# EAGLE design charger_1.2 (EAGLE 7.4.0)
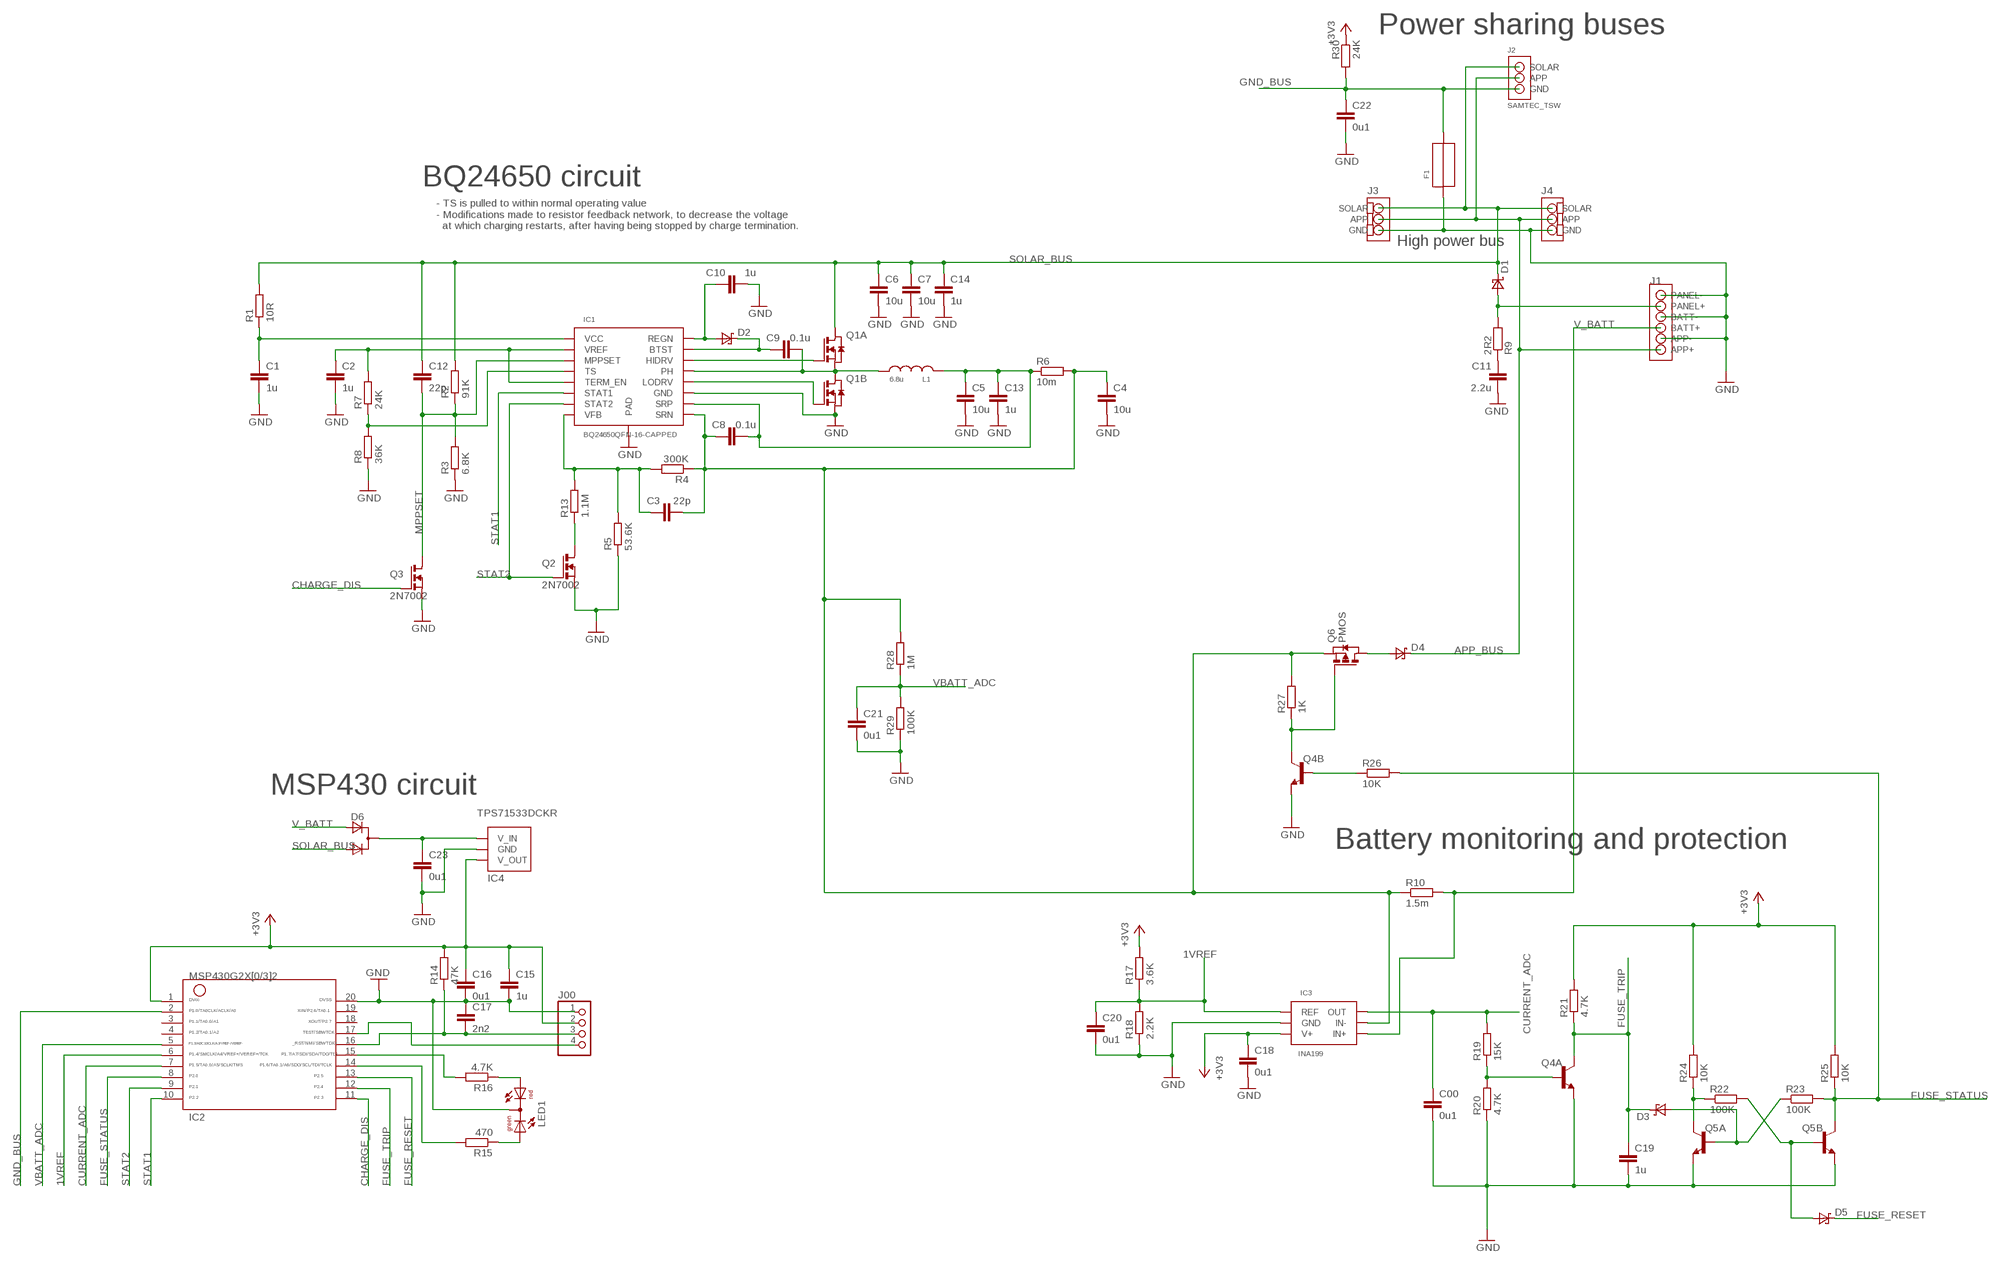
[diagram p0: schematic, sheet 1]

## Parts
C00  0u1  C-EUC0603K  [C0603K]
C1  1u  C-EUC0603  [C0603]
C2  1u  C-EUC0603  [C0603]
C3  22p  C-EUC0603  [C0603]
C4  10u  C-EUC1206  [C1206]
C5  10u  C-EUC1206  [C1206]
C6  10u  C-EUC1206  [C1206]
C7  10u  C-EUC1206  [C1206]
C8  0.1u  C-EUC0603  [C0603]
C9  0.1u  C-EUC0603  [C0603]
C10  1u  C-EUC0603  [C0603]
C11  2.2u  C-EUC0603  [C0603]
C12  22p  C-EUC0603  [C0603]
C13  1u  C-EUC0603  [C0603]
C14  1u  C-EUC0603  [C0603]
C15  1u  C-EUC0603K  [C0603K]
C16  0u1  C-EUC0603K  [C0603K]
C17  2n2  C-EUC0603K  [C0603K]
C18  0u1  C-EUC0603K  [C0603K]
C19  1u  C-EUC0603  [C0603]
C20  0u1  C-EUC0603K  [C0603K]
C21  0u1  C-EUC0603K  [C0603K]
C22  0u1  C-EUC0603K  [C0603K]
C23  0u1  C-EUC0603K  [C0603K]
D1  SCHOTTKYDPAK  [DPAK]
D2  SCHOTTKYSOT23  [SOT23]
D3  SCHOTTKYSOD-523F  [SOD-523F]
D4  SCHOTTKYSO8-FLAT  [SO8-FLAT]
D5  SCHOTTKYSOD-523F  [SOD-523F]
D6  D_2ASOT23  [SOT-23]
F1  FUSE2920  [2920]
IC1  BQ24650QFN-16-CAPPED  [QFN-16-CAPPED]
IC2  G2X[0/3]2---PW20  [PW20]
IC3  INA199  [SC70-6]
IC4  TPS71533DCKR  [SC70-5]
J00  PINHD-1X4  [1X04]
J1  TERMINALBLOCK  [TERMINALBLOCK]
J2  SAMTEC_TSW  [SAMTEC_TSW]
J3  TERMINALBLOCK_3_REV  [TERMINALBLOCK_3_REV]
J4  TERMINALBLOCK_3  [TERMINALBLOCK_3]
L1  6.8u  MULTICOMPINDUCTOR  [INDUCTOR]
LED1  DUOLED5MM  [DUOLED5MM]
Q1  SI7288DP  [POWERPAK-SO8-DUAL]
Q2  2N7002  [SOT23]
Q3  2N7002  [SOT23]
Q4  DUALNPN  [SC70-6]
Q5  DUALNPN  [SC70-6]
Q6  PMOS  [POWERPAK-SO8]
R1  10R  R-EU_R0603  [R0603]
R2  91K  R-EU_R0603  [R0603]
R3  6.8K  R-EU_R0603  [R0603]
R4  300K  R-EU_R0603  [R0603]
R5  53.6K  R-EU_R0805  [R0805]
R6  10m  R-EU_R1206  [R1206]
R7  24K  R-EU_R0603  [R0603]
R8  36K  R-EU_R0603  [R0603]
R9  2R2  R-EU_R0603  [R0603]
R10  1.5m  R-EU_R2010  [R2010]
R13  1.1M  R-EU_R0603  [R0603]
R14  47K  R-EU_R0603  [R0603]
R15  470  R-EU_R0603  [R0603]
R16  4.7K  R-EU_R0603  [R0603]
R17  3.6K  R-EU_R0603  [R0603]
R18  2.2K  R-EU_R0603  [R0603]
R19  15K  R-EU_R0603  [R0603]
R20  4.7K  R-EU_R0603  [R0603]
R21  4.7K  R-EU_R0603  [R0603]
R22  100K  R-EU_R0603  [R0603]
R23  100K  R-EU_R0603  [R0603]
R24  10K  R-EU_R0603  [R0603]
R25  10K  R-EU_R0603  [R0603]
R26  10K  R-EU_R0603  [R0603]
R27  1K  R-EU_R0603  [R0603]
R28  1M  R-EU_R0805  [R0805]
R29  100K  R-EU_R0603  [R0603]
R30  24K  R-EU_R0603  [R0603]

## Nets
1VREF: C20.1 IC2.6 IC3.EMITTER-B-1(REF) R17.1 R18.2
+3V3: C15.1 C16.1 C18.1 IC2.1 IC3.COLLECTOR-A-3(V+) IC4.OUT(V_OUT) J00.2 R14.2 R17.2 R21.2 R24.2 R25.2 R30.1
APP_BUS: D4.CATHODE J1.APP+ J2.APP J3.APP J4.APP
CHARGE_DIS: IC2.11 Q3.ANODE(G)
CURRENT_ADC: C00.1 IC2.7 IC3.COLLECTOR-B-6(OUT) R19.2
FUSE_RESET: D5.CATHODE IC2.13
FUSE_STATUS: IC2.8 Q5.COLLECTOR-B-6(B:COLLECTOR) R23.2 R25.1 R26.2
FUSE_TRIP: C19.1 D3.CATHODE IC2.12 Q4.COLLECTOR-A-3(A:COLLECTOR) R21.1
GND: C00.2 C1.2 C2.2 C4.2 C5.2 C6.2 C7.2 C10.2 C11.2 C13.2 C14.2 C15.2 C16.2 C17.1 C18.2 C19.2 C20.2 C21.2 C22.2 C23.2 F1.P$1 IC1.GND-P11(GND) IC1.P$17(PAD) IC1.P$18(PAD) IC1.P$19(PAD) IC1.P$20(PAD) IC2.20 IC3.BASE-B-2(GND) IC4.GND J00.1 J1.APP- J1.BATT- J1.PANEL- J3.GND J4.GND LED1.K(C) Q1.S2(B:S) Q2.NC(S) Q3.NC(S) Q4.EMITTER-B-1(B:EMMITER) Q4.EMMITER-A-4(A:EMMITER) Q5.EMITTER-B-1(B:EMMITER) Q5.EMMITER-A-4(A:EMMITER) R3.1 R5.1 R8.1 R18.1 R20.1 R29.1
GND_BUS: C22.1 F1.P$2 IC2.2 J2.GND R30.2
MPPSET: C12.2 IC1.MPPSET-P2(MPPSET) Q3.CATHODE(D) R2.1 R3.2
N$1: IC2.15 R16.2
N$2: IC1.HIDRV-P15(HIDRV) Q1.G1(A:G)
N$3: Q2.CATHODE(D) R13.1
N$4: LED1.AR R16.1
N$5: C9.2 IC1.PH-P14(PH) L1.P$2 Q1.D2A(B:D) Q1.D2B(B:D) Q1.D2C(B:D) Q1.S1(A:S)
N$6: IC1.TS-P4(TS) R7.1 R8.2
N$7: C9.1 D2.CATHODE IC1.BTST-P16(BTST)
N$8: IC1.LODRV-P13(LODRV) Q1.G2(B:G)
N$9: C3.1 IC1.VFB-P8(VFB) R4.2 R5.2 R13.2
N$10: C10.1 D2.ANODE IC1.REGN-P12(REGN)
N$11: IC2.17 J00.4
N$12: Q4.BASE-A-5(A:BASE) R19.1 R20.2
N$13: LED1.AG R15.1
N$15: D5.ANODE Q5.BASE-B-2(B:BASE) R22.2
N$16: Q5.COLLECTOR-A-3(A:COLLECTOR) R22.1 R24.1
N$17: C2.1 IC1.TERM_EN-P7(TERM_EN) IC1.VREF-P6(VREF) R7.2
N$18: D3.ANODE Q5.BASE-A-5(A:BASE) R23.1
N$19: Q4.COLLECTOR-B-6(B:COLLECTOR) Q6.G R27.1
N$20: D4.ANODE1(ANODE) D4.ANODE2(ANODE) D4.ANODE3(ANODE) Q6.D1(D) Q6.D2(D) Q6.D3(D) Q6.D4(D)
N$21: IC2.14 R15.2
N$22: Q4.BASE-B-2(B:BASE) R26.1
N$25: C23.1 D6.1(C) IC4.IN(V_IN)
N$40: C17.2 IC2.16 J00.3 R14.1
SOLAR_BUS: C6.1 C7.1 C12.1 C14.1 D1.CATHODE D6.3(A2) J2.SOLAR J3.SOLAR J4.SOLAR Q1.D1A(A:D) Q1.D1B(A:D) Q1.D1C(A:D) R1.2 R2.2
SOLAR_IN: D1.ANODE1(ANODE) D1.ANODE2(ANODE) J1.PANEL+ R9.2
SRP: C5.1 C8.2 C13.1 IC1.SRP-P10(SRP) L1.P$1 R6.1
STAT1: IC1.STAT1-P3(STAT1) IC2.10
STAT2: IC1.STAT2-P5(STAT2) IC2.9 Q2.ANODE(G)
V_BATT: D6.2(A1) IC3.EMMITER-A-4(IN+) J1.BATT+ R10.2
V_CHARGE: C3.2 C4.1 C8.1 IC1.SRN-P9(SRN) IC3.BASE-A-5(IN-) Q6.S1(S) Q6.S2(S) Q6.S3(S) R4.1 R6.2 R10.1 R27.2 R28.2
VBATT_ADC: C21.1 IC2.5 R28.1 R29.2
VCC: C1.1 IC1.VCC-P1(VCC) R1.1
VCC1: C11.1 R9.1
Unconnected: IC2.3 IC2.4 IC2.18 IC2.19

## Notes on the sheet
- Power sharing buses
- BQ24650 circuit
- - TS is pulled to within normal operating value
   - Modifications made to resistor feedback network, to decrease the voltage
     at which charging restarts, after having being stopped by charge termination.
- High power bus
- MSP430 circuit
- Battery monitoring and protection

## Library data of the parts
C00 C1-C23 = rcl:C-EU: CAPACITOR, European symbol
D1-D5 = myChargerLib:SCHOTTKY: DIODE
D6 = zetex:D_2A: Dual DIODE; OC_FARNELL: unknown; OC_NEWARK: unknown
F1 = mylib:FUSE
IC1 = myChargerLib:BQ24650
IC2 = TI_MSP430_v16:G2X[0/3]2---PW20: MSP430G2X[0/3]2 MSP430G2x32, MSP430G2x02 TSSOP (PW) 20 Pin Package http://focus.ti.com/docs/prod/folders/print/msp430g2432.html
IC3 = myChargerLib:INA199
IC4 = mylib:TPS71533DCKR
J00 = pinhead:PINHD-1X4: PIN HEADER
J1 = myChargerLib:TERMINALBLOCK
J2 = myChargerLib:SAMTEC_TSW
J3 = myChargerLib:TERMINALBLOCK_3_REV
J4 = myChargerLib:TERMINALBLOCK_3
L1 = myChargerLib:MULTICOMPINDUCTOR
LED1 = mylib:DUOLED5MM: DUO LED 2 colors, 5 mm, round
Q1 = myChargerLib:SI7288DP
Q2 Q3 = myChargerLib:2N7002
Q4 Q5 = myChargerLib:DUALNPN
Q6 = myChargerLib:PMOS
R1-R10 R13 R14 R17-R30 = rcl:R-EU_: RESISTOR, European symbol
R15 R16 = resistor:R-EU_: RESISTOR, European symbol

## Board
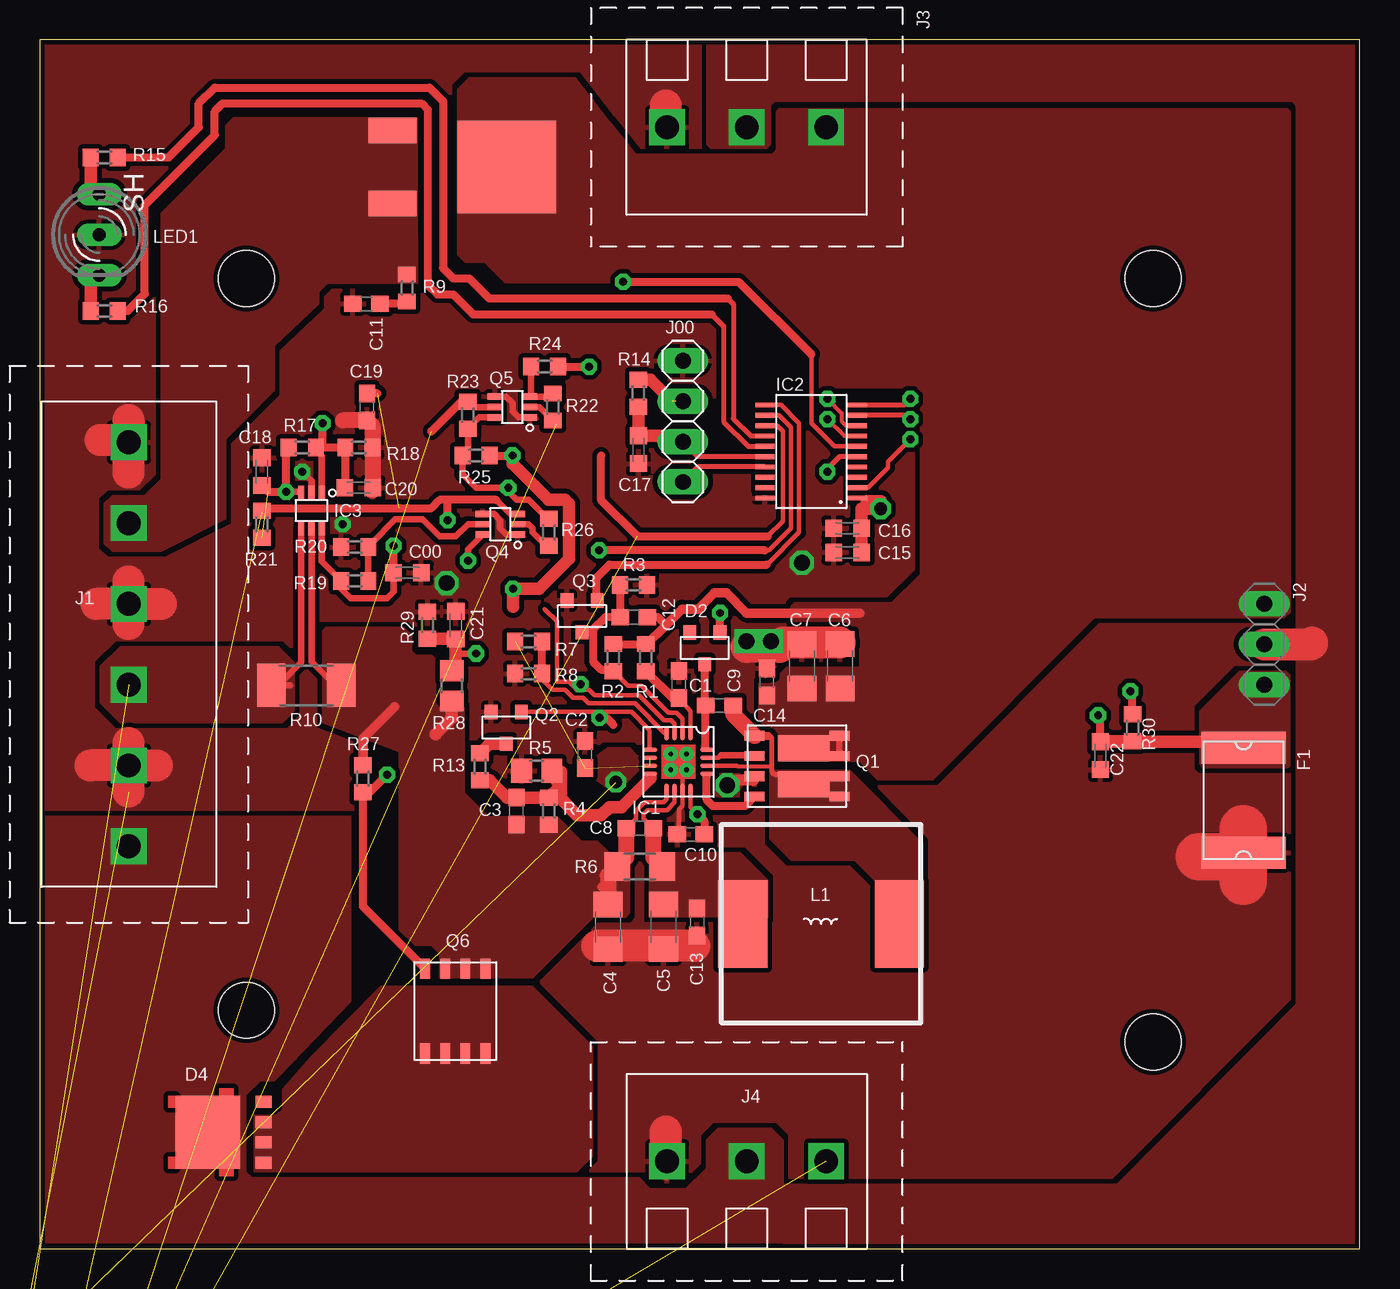
[diagram p1: board, top side]
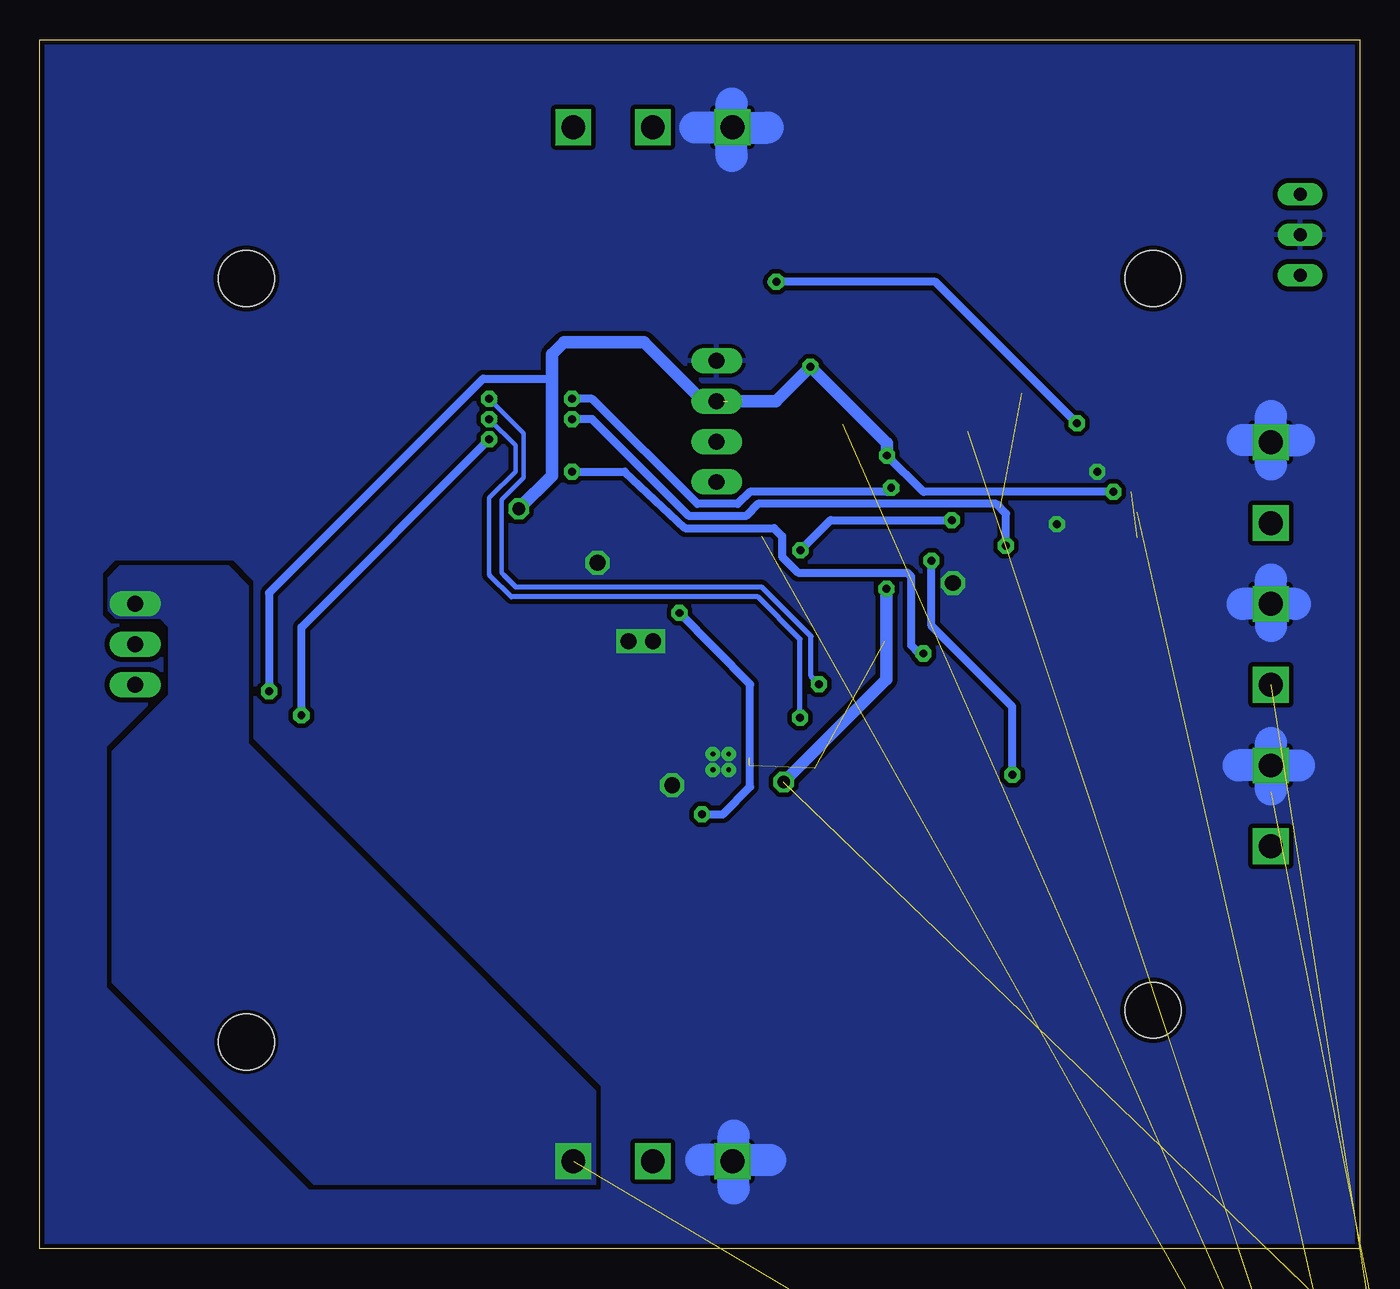
[diagram p2: board, bottom side, seen from below]

Size 83 x 76 mm. Coordinates in mm from the lower left corner, seen from the top.
Outline: 0,76 0,0 83,0 83,76 0,76
Copper layers (1*16): Top 0.035mm / dielectric 1.5mm / Bottom 0.035mm
Design rules "SparkFun *": minimum track width 8mil, minimum drill 10mil, track to track 8mil, track to pad 8mil, pad to pad 8mil, via to via 8mil, smd to smd 8mil, copper to edge 10mil, drill to drill 8mil, minimum pad ring 12mil, minimum via ring 10mil, stop-mask expansion 4mil, vias tented up to drill 25mil, thermal gap 10mil
Holes 3.5 mm at 13,61 13,15 70,13 70,61
tKeepout: area 9.5,57.5 to 16.5,64.5; area 9.5,11.5 to 16.5,18.5; area 66.5,57.5 to 73.5,64.5; area 66.5,9.5 to 73.5,16.5

### Footprints (pad centres in the part's own frame; a part is rotated, then mirrored left to right if it is on the bottom)
C0603K = smd 1.05 x 1.08: 1 -0.875,0; 2 0.875,0
C0603 = smd 1.1 x 1: 1 -0.85,0; 2 0.85,0
C1206 = smd 1.6 x 1.8: 1 -1.4,0; 2 1.4,0
DPAK = smd 3 x 1.6: ANODE1 4.08,5.185; ANODE2 4.08,0.615 | smd 6.2 x 5.8: CATHODE -3.1,2.9
SOT23 = smd 0.8 x 0.9: ANODE 0.95,0.975; CATHODE 0,-1.025; NC -0.95,0.975
SOD-523F = smd 0.5 x 0.8: ANODE 0,-1; CATHODE 0,1
SO8-FLAT = smd 0.75 x 1: ANODE1 4.185,5.52; ANODE2 2.915,5.52; ANODE3 1.645,5.52; NC-4 0.375,5.52 | smd 4.56 x 4.055: CATHODE 2.28,2.027
SOT-23 = smd 0.787 x 0.889: 1 0.025,-1.016; 2 -0.94,1.016; 3 0.991,1.016
2920 = smd 2 x 5.3: P$1 3.3,0; P$2 -3.3,0
QFN-16-CAPPED = smd 0.9 x 0.28: BTST-P16 1.8,0.75; HIDRV-P15 1.8,0.25; LODRV-P13 1.8,-0.75; PH-P14 1.8,-0.25; STAT2-P5 -1.8,0.75; TERM_EN-P7 -1.8,-0.25; VFB-P8 -1.8,-0.75; VREF-P6 -1.8,0.25 | smd 0.28 x 0.9: GND-P11 0.25,-1.8; MPPSET-P2 0.25,1.8; REGN-P12 0.75,-1.8; SRN-P9 -0.75,-1.8; SRP-P10 -0.25,-1.8; STAT1-P3 -0.25,1.8; TS-P4 -0.75,1.8; VCC-P1 0.75,1.8 | drill 0.3 pad 0.4: P$17 -0.5,0.5; P$18 0.5,0.5; P$19 0.5,-0.5; P$20 -0.5,-0.5
PW20 = smd 0.3 x 1.2: 1 -2.925,-2.9; 2 -2.275,-2.9; 3 -1.625,-2.9; 4 -0.975,-2.9; 5 -0.325,-2.9; 6 0.325,-2.9; 7 0.975,-2.9; 8 1.625,-2.9; 9 2.275,-2.9; 10 2.925,-2.9; 11 2.925,2.9; 12 2.275,2.9; 13 1.625,2.9; 14 0.975,2.9; 15 0.325,2.9; 16 -0.325,2.9; 17 -0.975,2.9; 18 -1.625,2.9; 19 -2.275,2.9; 20 -2.925,2.9
SC70-6 = smd 0.4 x 0.9: BASE-A-5 0,1.1; BASE-B-2 0,-1.1; COLLECTOR-A-3 0.65,-1.1; COLLECTOR-B-6 -0.65,1.1; EMITTER-B-1 -0.65,-1.1; EMMITER-A-4 0.65,1.1
SC70-5 = smd 0.4 x 0.7: FB/NC -0.65,-0.85; GND 0,-0.85; IN 0.65,0.85; NC 0.65,-0.85; OUT -0.65,0.85
1X04 = drill 1 long: 1 -3.81,0; 2 -1.27,0; 3 1.27,0; 4 3.81,0
TERMINALBLOCK = drill 1.5 square: APP+ 12.7,0; APP- 7.62,0; BATT+ 2.54,0; BATT- -2.54,0; PANEL+ -7.62,0; PANEL- -12.7,0
SAMTEC_TSW = drill 1 long: APP 0,0; GND 2.54,0; SOLAR -2.54,0
TERMINALBLOCK_3_REV = drill 1.5 square: APP 0,-5; GND 0,-10; SOLAR 0,0
TERMINALBLOCK_3 = drill 1.5 square: APP 0,-5; GND 0,-10; SOLAR 0,0
INDUCTOR = smd 3.1 x 5.5: P$1 -4.925,0; P$2 4.925,0
DUOLED5MM = drill 0.813 long: AG -2.54,0; AR 2.54,0; K 0,0
POWERPAK-SO8-DUAL = smd 1.27 x 0.61: D1A 2.67,1.905; D1B 2.67,0.635; D2A 2.67,-0.635; D2B 2.67,-1.905; G1 -2.67,0.635; G2 -2.67,-1.905; S1 -2.67,1.905; S2 -2.67,-0.635 | smd 3.25 x 1.65: D1C 0.41,1.13; D2C 0.41,-1.13
POWERPAK-SO8 = smd 1.27 x 0.61: D1 2.67,1.905; D2 2.67,0.635; D3 2.67,-0.635; D4 2.67,-1.905; G -2.67,-1.905; S1 -2.67,1.905; S2 -2.67,0.635; S3 -2.67,-0.635
R0603 = smd 1 x 1.1: 1 -0.85,0; 2 0.85,0
R0805 = smd 1.3 x 1.5: 1 -0.95,0; 2 0.95,0
R1206 = smd 1.6 x 1.803: 1 -1.422,0; 2 1.422,0
R2010 = smd 1.8 x 2.7: 1 -2.2,0; 2 2.2,0

### Placement (x,y rotation side)
C00  23.11,42.5 0 top
C1  40.19,35.48 90 top
C2  34.29,31.07 90 top
C3  29.97,27.52 270 top
C4  35.73,20.23 270 top
C5  39.22,20.25 270 top
C6  50.33,36.63 90 top
C7  47.93,36.63 90 top
C8  37.73,26.43 0 top
C9  42.74,34.15 0 top
C10  40.94,26.06 180 top
C11  20.53,59.41 180 top
C12  37.34,39.71 180 top
C13  41.33,20.53 270 top
C14  45.73,35.63 90 top
C15  50.8,43.77 180 top
C16  50.8,45.3 180 top
C17  37.64,50.24 90 top
C18  13.97,48.85 90 top
C19  20.57,52.92 270 top
C20  20.07,47.84 0 top
C21  26.16,39.2 90 top
C22  66.7,31 270 top
C23  -3,-18 0 top  (outside the outline)
D1  26.27,70.9 180 top
D2  41.82,37.77 0 top
D3  -4,-34 0 top  (outside the outline)
D4  8.56,9.61 270 top
D5  -4,-30 0 top  (outside the outline)
D6  -3,-26 0 top  (outside the outline)
F1  75.69,28.19 270 top
IC1  40.17,30.61 0 top
IC2  48.51,50.12 90 top
IC3  17.09,46.41 180 top
IC4  -2,-9 0 top  (outside the outline)
J00  40.44,52.01 270 top
J1  5.6,38 270 top
J2  77,38 270 top
J3  49.45,70.5 270 top
J4  49.45,5.5 270 top
L1  49.13,20.43 0 top
LED1  3.75,63.75 270 top
Q1  47.62,30.34 0 top
Q2  29.33,32.78 0 top
Q3  34.1,39.78 0 top
Q4  28.96,45.55 90 top
Q5  29.72,52.92 90 top
Q6  26.13,14.94 270 top
R1  38.1,37.17 90 top
R2  36.07,37.17 90 top
R3  37.34,41.74 180 top
R4  32,27.52 90 top
R5  31.24,30.06 0 top
R6  37.73,24.03 180 top
R7  30.73,38.18 180 top
R8  30.73,36.15 0 top
R9  23.1,60.4 90 top
R10  16.76,35.42 180 top
R13  27.69,30.31 270 top
R14  37.64,53.79 90 top
R15  4.06,68.61 0 top
R16  4.06,58.96 0 top
R17  16.51,50.38 180 top
R18  20.07,50.38 180 top
R19  19.81,41.99 180 top
R20  19.81,44.11 0 top
R21  13.97,45.55 270 top
R22  32.26,52.92 270 top
R23  26.92,52.41 270 top
R24  31.75,55.46 0 top
R25  27.43,49.87 0 top
R26  32,45.04 90 top
R27  20.32,29.55 90 top
R28  25.91,35.39 270 top
R29  24.38,39.2 270 top
R30  68.72,32.75 270 top

### Tracks (layer width: path | path; a pad name or v marks a point on that pad's centre or on a via)
1VREF  (via drill 0.5)
  Top 0.28: 48.51,56.22 48.51,51.9 49.97,50.45 IC2.6
  Top 0.4: IC3.EMITTER-B-1 17.74,49.87 R17.1
  Top 0.5: R17.1 17.53,50.38 | 17.53,50.38 R18.2 19.22,47.84 C20.1 | 17.53,50.38 17.78,50.63 v17.78,51.9 | v36.69,60.79 43.94,60.79 48.51,56.22
  Bottom 0.5: v17.78,51.9 26.67,60.79 v36.69,60.79 37,60.79
+3V3  (via drill 0.5, 0.8)  (3 unrouted)
  Top 0.3: 52,47 52,47.2 IC2.1
  Top 0.4: IC3.COLLECTOR-A-3 16.37,47.58 v15.49,47.58
  Top 0.5: R24.2 v34.54,55.46 | R25.2 v29.72,49.87 | C18.1 14.37,47.58 v15.49,47.58 15.49,49.87 R17.2 | R30.1 68.72,34.92 v68.58,35.05
  Top 0.8: R14.2 38.41,54.64 39.76,53.28 J00.2 | C15.1 C16.1 51.67,46.52 v52.88,46.52 52.88,47 52,47 | 29.75,40.35 v29.75,41.48 29.76,41.5 31.4,41.5 33.27,43.37 33.27,46.82 33.02,47.07 32,47.07 29.72,49.36 v29.72,49.87
  Bottom 0.5: v15.49,47.58 27.43,47.58 v29.72,49.87 | 50.8,54.69 55.12,54.69 68.58,41.23 v68.58,35.05
  Bottom 0.8: v29.72,49.87 29.72,50.63 v34.54,55.46 36.72,53.28 40,53.28 | J00.2 41.28,53.28 45,57 50.02,57 50.8,56.22 50.8,54.69 50.8,48.6 v52.88,46.52 | 29.72,41.51 v29.75,41.48 29.75,35.81 v36.22,29.34
  pour Top (isolate 0.305, no thermals): 38.7,31 37.6,31 37.1,31.5 35.7,31.5 34.75,30.8 34.75,29.6 35.56,29.04 36.64,29.04 37.9,30.3 38.6,30.3 38.7,30.4
APP_BUS
  Top 2: J2.APP 79.91,38 arc90 80.01,38.1
  pour Top (isolate 0.305, no thermals): 12.95,9.68 12.95,4.86 13.32,4.49 37.68,4.49 38.35,3.81 40.64,3.81 41.91,5.08 41.91,6.86 42.67,7.62 45.97,7.62 46.74,6.86 46.74,0.35 0.35,0.35 0.35,27.21 19.56,27.21 19.56,15.53 14.99,10.79 14.73,10.54 13.84,10.54 12.99,9.68
  pour Top (isolate 0.305, no thermals): 46.74,0.35 82.7,0.35 82.7,75.69 41.91,75.69 41.91,69.44 42.16,69.19 45.72,69.19 45.97,69.44 45.97,71.88 46.23,72.14 78.74,72.14 78.99,71.88 78.99,15.34 67.72,4.06 46.74,4.06
CHARGE_DIS
  Top 0.28: 45.72,43.01 47.75,45.04 47.75,51.9 46.6,53.05 IC2.11
  Top 0.5: Q3.ANODE 35,40.81 35,42.2 35.81,43.01 45.72,43.01
CURRENT_ADC  (via drill 0.5)
  Top 0.25: v49.53,52.15 50.59,51.1 IC2.7
  Top 0.4: IC3.COLLECTOR-B-6 17.74,43.22 R19.2 18.96,41.49 19.56,40.89 21.84,40.89 22.24,41.29 C00.1
  Top 0.5: C00.1 v22.24,44.19 v22.25,44.2
  Bottom 0.5: v22.25,44.2 22.25,46.21 22.86,46.82 37.85,46.82 38.61,46.06 42.16,46.06 48.26,52.15 v49.53,52.15
FUSE_RESET  (1 unrouted)
  Top 0.28: 45.77,44.79 46.74,45.75 46.74,51.39 46.38,51.75 IC2.13
  Top 0.5: 45.77,44.79 37.58,44.79 35.31,47.06 35.31,49.87
FUSE_STATUS  (via drill 0.5)
  Top 0.25: v49.53,53.42 50.42,52.53 50.42,52.03 50.7,51.75 IC2.8
  Top 0.4: Q5.COLLECTOR-B-6 27.61,52.27 R23.2 26.92,50.21 R25.1 26.58,48.69 27.43,47.84 29.21,47.84 29.97,47.07 30.73,47.07 31.92,45.89 R26.2
  Top 0.5: 29.21,47.84 v29.46,47.84
  Bottom 0.5: v49.53,53.42 48.26,53.42 41.66,46.82 39.12,46.82 38.35,47.58 29.72,47.58 v29.46,47.84
FUSE_TRIP  (via drill 0.5)  (2 unrouted)
  Top 0.28: IC2.12 45.62,52.41 46.48,52.41 47.24,51.65 47.24,45.3 45.85,43.9 45.59,43.9
  Top 0.4: Q4.COLLECTOR-A-3 29.58,46.2 28.7,47.07
  Top 0.5: 28.7,47.07 25.65,47.07 | 25.65,47.07 25.15,47.07 24.64,46.57 23.11,46.57 | 13.97,46.31 R21.1 13.97,46.57 22.61,46.57 | 22.61,46.57 23.11,46.57 | 23.11,46.58 23.11,46.57 | 22.6,46.58 22.61,46.57 | 21.24,53.77 C19.1 | 45.59,43.9 v35.18,43.9 | v25.65,45.8 25.65,47.07
  Bottom 0.5: v35.18,43.9 33.27,45.8 v25.65,45.8
GND  (via drill 0.5, 1)  (2 unrouted)
  Top 0.2: Q1.S2 44.95,29.54 44.86,29.45
  Top 0.28: IC1.P$19 40.42,29.86 IC1.GND-P11 40.42,27.86 40.18,27.62 40.18,25.99
  Top 0.4: Q5.EMITTER-B-1 30.11,52.27 29.72,52.66 29.72,53.17 29.32,53.57 Q5.EMMITER-A-4 | Q4.EMMITER-A-4 28.56,46.2 28.96,45.8 28.96,45.3 29.35,44.9 Q4.EMITTER-B-1 | 17.09,48.26 arc-90 17.09,48.26 | IC3.BASE-B-2 17.09,48.26 | 17.09,48.26 17.09,48.27 v16.51,48.85
  Top 0.5: C13.2 41.15,19.5 41.15,19.05 | 40.18,25.99 40.13,26.04 40.13,26.16 40.09,26.12 C10.2
  Top 0.7: 44.86,29.45 43.64,29.45 43.23,29.04
  Top 1: 19.07,52.08 C19.2 20.92,51.72 20.92,47.68
  Top 2: 39.37,5.33 39.37,7.37 | 39.37,70.61 39.37,71.88 | 5.59,48.8 5.59,50.83 | 5.59,52.1 5.59,50.83 | 5.59,50.83 3.81,50.83 | 5.59,40.55 5.59,41.94 | 5.59,39.27 5.59,40.55 | 5.59,40.55 7.62,40.55 | 5.59,40.55 3.56,40.55 | 5.59,30.39 5.59,31.78 | 5.59,28.73 5.59,30.39 | 5.59,30.39 7.37,30.39 | 5.59,30.39 3.17,30.39 | 50.29,38.1 46.74,38.1 46.48,37.85 44.45,37.85 | 41.15,19.05 35.05,19.05
  Top 3: 75.69,24.64 75.69,26.42 | 75.69,23.11 75.69,24.64 | 75.69,24.64 72.9,24.64
  Bottom 2: 39.37,5.59 39.37,7.11 | 39.37,3.81 39.37,5.59 | 39.37,5.59 37.08,5.59 | 39.37,5.59 41.4,5.59 | 39.5,70.48 39.5,72.01 | 39.5,68.71 39.5,70.48 | 39.5,70.48 37.21,70.48 | 39.5,70.48 41.78,70.48 | 5.59,50.83 5.59,52.36 | 5.59,49.31 5.59,50.83 | 5.59,50.83 3.81,50.83 | 5.59,50.83 7.37,50.83 | 5.59,40.55 7.37,40.55 | 4.06,40.55 5.59,40.55 | 5.59,40.55 5.59,42.07 | 5.59,40.55 5.59,39.15 | 5.59,30.39 5.59,31.78 | 5.59,28.86 5.59,30.39 | 5.59,30.39 7.62,30.39 | 5.59,30.39 3.81,30.39
  other vias: 43.23,29.15 45.97,38.18 44.45,38.18 25.58,41.85 47.93,43.12 19.05,45.55
  pour Bottom (isolate 0.305, rank 4): 0,76 0,0 83,0 83,76
  pour Top (isolate 0.305, rank 4): 0,76 0,0 83,0 83,76
GND_BUS  (via drill 0.5)
  Top 0.28: IC2.2 52.08,47.85 53.34,49.11 53.34,49.49 v54.74,50.88
  Top 0.5: C22.1 66.7,33.38 v66.55,33.53
  Top 0.8: F1.P$2 75.69,31.88 C22.1 66.7,31.9 R30.2
  Bottom 0.5: v66.55,33.53 66.55,39.07 v54.74,50.88
  pour Top (isolate 0.305, no thermals): 78.39,36.32 75.44,36.32 72.9,33.78 72.9,30.48 73.15,30.23 78.49,30.23 78.64,30.38 78.64,36.07
MPPSET
  Top 0.28: IC1.MPPSET-P2 40.42,33.32 40.03,33.71 39.52,33.71 37.85,35.39 37,35.39 R2.1
  Top 0.5: 34.8,38.69 34.8,38.95 35.56,39.71 C12.2 R3.2 | 34.8,38.69 34.8,36.91 35.31,36.41 35.98,36.41 R2.1 | Q3.CATHODE 34.73,38.76 34.8,38.69
N$1
  Top 0.3: 42.25,58.75 43,58 43,52 44.55,50.45 IC2.15
  Top 0.5: R16.2 5.53,58.96 6.6,60.03 6.6,65.62 6.62,65.62 11,70 11,71.5 11.5,72 24,72 24.4,71.6 24.4,60.6 25,60 26,60 27.25,58.75 42.25,58.75
N$2
  Top 0.28: IC1.HIDRV-P15 42.68,30.86 42.84,31.02
  Top 0.4: 42.84,31.02 44.91,31.02 Q1.G1
N$3
  Top 0.8: Q2.CATHODE 28.28,31.75 R13.1
N$4
  Top 0.8: R16.1 3.21,60.68 LED1.AR
N$5
  Top 0.2: 46.35,29.8 50.2,29.8 arc-90 Q1.D2A
  Top 0.25: 43.87,30.34 45.98,30.34
  Top 0.28: IC1.PH-P14 43.85,30.36 43.87,30.34 | 45.98,30.34 46.02,30.3
  Top 0.3: 45.81,32.25 arc-90 46.02,32.04 46.02,30.3 46.02,30.13 arc90 46.35,29.8
  Top 0.5: Q1.S1 45.81,32.25
  Top 1: C9.2 43.59,33.61 Q1.S1
  pour Top (isolate 0.305, no thermals): 45.88,30.08 45.88,25.78 47.23,24.43 51.23,24.43 52.73,22.93 55.58,22.93 55.58,25.43 50.93,30.08
N$6
  Top 0.28: IC1.TS-P4 39.3,32.41 37.43,34.28 34.5,34.28 34.15,34.63 33.95,34.63 33.53,34.63 33.02,35.14 32.26,35.14 31.58,35.81 R8.2
  Top 0.5: R8.2 R7.1
N$7
  Top 0.1: 41.83,31.53 41.97,31.53 IC1.BTST-P16
  Top 0.406: C9.1 41.83,34.15
  Top 0.5: 41.83,31.53 41.83,34.15 41.83,36.74 D2.CATHODE
N$8
  Top 0.1: 41.93,29.7 41.93,29.82 IC1.LODRV-P13
  Top 0.5: Q1.G2 44.34,27.83 42.33,27.83 41.93,28.23 41.93,29.7
N$9
  Top 0.28: 38.4,29.6 38.37,29.63 IC1.VFB-P8
  Top 0.8: 38.4,29.6 38.4,29.59 36.58,27.77 35.81,27.77 35.31,27.26 33.78,27.26 32.77,28.28 32.77,29.99 R5.2 32.7,29.06 R4.2 C3.1 29.38,28.37 28.28,29.46 R13.2
N$10  (via drill 0.5)
  Top 0.28: IC1.REGN-P12 40.92,27.75 v41.36,27.31
  Top 0.5: v41.36,27.31 41.79,26.88 C10.1 | 42.76,39.92 v42.78,39.97 42.77,39.96 D2.ANODE
  Bottom 0.5: v41.36,27.31 40.05,27.31 38.33,29.03 38.33,35.49 v42.78,39.97
N$11
  Top 0.3: IC2.17 41.38,49.15 J00.4
N$12
  Top 0.4: Q4.BASE-A-5 26.92,45.55 26.16,44.79 25.15,44.79 24.09,45.85 22.35,45.85 20.87,44.37 R20.2 R19.1
N$13
  Top 0.8: R15.1 3.21,66.83 LED1.AG
N$15  (1 unrouted)
  Top 0.4: R22.2 31.43,52.92 Q5.BASE-B-2
  Top 0.5: 32.49,51.83 R22.2
N$16
  Top 0.4: 32.21,53.57 Q5.COLLECTOR-A-3 30.9,53.65 R24.1
  Top 0.5: R22.1 32.21,53.57
N$17  (3 unrouted)
N$18  (1 unrouted)
  Top 0.4: Q5.BASE-A-5 27.26,52.92 R23.1 26.88,53.3
  Top 0.5: 26.88,53.3 26.55,53.3 24.64,51.39 24.64,51.42
N$19  (via drill 0.5)
  Top 0.4: Q4.COLLECTOR-B-6 26.92,43.97 v26.92,43.26
  Top 0.5: R27.1 20.74,28.7 v21.84,29.8 | Q6.G 20.32,21.52 R27.1 | 20.32,28.96 R27.1
  Bottom 0.5: v21.84,29.8 21.84,34.08 26.92,39.16 v26.92,43.26
N$20
  pour Top (isolate 0.305, no thermals): 13.46,8.41 13.46,4.84 33.8,4.84 34.8,5.84 34.8,12.7 30.99,16.51 21.45,16.51 17,12 15.25,10 15.25,8.75 14.86,8.41
N$21
  Top 0.3: 43.25,59.75 43.62,59.38 43.62,52.19 44.71,51.1 IC2.14
  Top 0.5: 43.25,59.75 28.25,59.75 27,61 26,61 25.35,61.65 25.35,72.15 24.5,73 11,73 10,72 10,70.5 8.11,68.61 R15.2
N$22
  Top 0.4: R26.1 31.84,44.19 30.99,45.04 30.99,45.3 30.73,45.55 Q4.BASE-B-2
N$25  (2 unrouted)
N$40
  Top 0.3: IC2.16 41.38,49.8 J00.3
  Top 0.8: J00.3 40.07,51.11 C17.2 R14.1
SOLAR_BUS  (1 unrouted)
  Top 0.4: Q1.D1B Q1.D1A
  Top 0.5: R2.2 R1.2 | C12.1 38.86,39.71 39.37,39.2
  Top 0.6: R1.2 38.1,37.93 39.37,39.2 39.62,39.45 40.39,40.22 41.4,40.22 42.42,41.23 43.18,41.23 44.45,39.96 51.56,39.96
  pour Top (isolate 0.305, no thermals): 28,62 26.78,61.98 26.27,62.48 26.27,72.9 27.03,73.66 33.65,73.66 35.8,70.87 35.81,70.87 37.47,68.83 46.07,68.83 46.33,69.09 46.33,71.49 46.53,71.69 78.44,71.69 78.64,71.49 78.64,40.02 78.24,39.62 66.29,39.62 56.13,29.46 52.7,29.46 51.56,30.61 46.48,30.61 46.48,32 45.21,33.27 45.21,35.56 45.97,35.56 46.99,36.58 51.56,36.58 51.56,38.86 51.31,39.12 47.75,39.12 47.24,39.62 47.24,40.39 47.5,40.64 53.59,40.64 55.37,42.42 55.37,53.85 55.12,54.1 48.77,54.1 48.51,54.36 48.51,56.39 48.26,56.39 43.94,60.71 29.29,60.71
  pour Bottom (isolate 0.254, no thermals): 50.8,4.06 48.01,4.06 48.01,7.11 48.01,9.91 69.85,31.75 69.85,39.37 69.85,41.66 71.12,42.93 77.98,42.93 78.74,42.16 78.74,40.13 78.23,39.62 75.44,39.62 74.93,39.12 74.93,34.8 78.49,31.24 78.49,16.76 65.79,4.06
SOLAR_IN
  pour Top (isolate 0.305, no thermals): 4.06,46.85 4.57,47.36 6.6,47.36 7.62,48.38 7.62,65.11 11.68,69.17 11.68,70.62 12.18,71.12 23.73,71.12 23.74,66.67 23.75,60.66 18.04,60.64 17.54,60.14 17.54,59.38 14.75,56.75 14.75,53.95 11.68,50.88 11.68,45.87 7.62,43.8 4.57,43.8 4.06,44.31
SRP
  Top 0.28: C8.2 37.98,27.03 37.98,27.33 38.23,27.58 39.43,27.58 39.92,28.07 IC1.SRP-P10
  Top 1: R6.1 38.58,24.6 C8.2
  pour Top (isolate 0.305, no thermals): 45.78,20.83 38.33,20.83 38.33,24.93 44.03,24.93 45.78,23.18
STAT1  (via drill 0.5)
  Top 0.203: IC1.STAT1-P3 39.92,32.96
  Top 0.28: IC1.STAT1-P3 39.92,33 39.7,33.21 39.26,33.21 37.67,34.8 34.88,34.8 34.54,35.14 33.78,35.14 33.27,35.64 32.51,35.64 32.51,39.45 31.75,40.22
  Top 0.3: 33.78,35.14 34,35.35 v34,35.5 | IC2.10 54.36,53.05 v54.74,53.42
  Bottom 0.28: 53.85,42.38 53.98,42.5 53.98,47.07 52.58,48.47 52.58,51.27 v54.74,53.42
  Bottom 0.3: v34,35.5 34.5,36 34.5,38.5 37.61,41.61 53.09,41.61 53.85,42.38
STAT2  (via drill 0.5)
  Top 0.28: IC1.STAT2-P5 38.35,31.38 38.35,32.6 37.2,33.75 Q2.ANODE 35.19,33.75 v35.19,33.38
  Top 0.3: v54.74,52.15 54.49,52.4 IC2.9
  Top 0.5: 36.07,32.94 35.63,33.38 v35.19,33.38
  Bottom 0.28: 54.74,42.38 54.74,47.2 53.09,48.85 53.09,50.5 v54.74,52.15
  Bottom 0.3: v35.19,33.38 35.19,38.32 37.85,40.98 53.34,40.98 54.74,42.38
V_BATT  (1 unrouted)
  Top 0.4: R10.2 15,35.42 | 15,35.42 15.75,35.42 | IC3.EMMITER-A-4 16.44,36.86 15,35.42
  pour Top (isolate 0.305, no thermals): 3.81,36.61 5.08,37.88 14.99,37.88 16,36.86 16,33.81 15.24,33.05 5.08,33.05 3.81,34.32
V_CHARGE
  Top 0.28: C8.1 37.48,27.03 37.48,27.53 38.03,28.08 39.23,28.08 39.42,28.27 IC1.SRN-P9
  Top 0.4: IC3.BASE-A-5 17.09,36.91 19,35 19,35.39 R10.1
  Top 0.5: 35.31,22.74 36.38,23.82 36.38,24.11
  Top 0.6: R27.2 20.32,32.09 22.31,34.08
  Top 0.8: R28.2 25.91,33.36 24.89,32.34
  Top 1: C4.1 35.73,23.45 R6.2 36.38,24.11 36.88,24.6 C8.1
  pour Top (isolate 0.305, no thermals): 25.15,18.54 24.64,19.05 23.62,19.05 22.61,20.07 22.61,31.23 17.78,33.05 17.78,38.86 18.03,39.12 22.86,39.12 23.37,38.61 23.37,37.59 23.62,37.34 24.64,37.34 24.89,37.08 24.89,34.29 25.15,34.04 26.67,34.04 26.67,28.7 28.19,27.18 32.51,27.18 34.04,25.65 35.05,25.65 35.81,24.89 36.32,24.89 37.08,24.13 37.08,21.08 36.83,20.83 34.8,20.83 30.99,17.02 25.15,17.02
VBATT_ADC  (via drill 0.5)
  Top 0.3: IC2.5 50.3,49.8 49.53,49.03 v49.53,48.85
  Top 0.4: 26.16,37.42 v27.43,37.42
  Top 0.8: R28.1 26.16,36.59 26.16,37.42 C21.1 26.14,38.35 R29.2
  Bottom 0.5: v49.53,48.85 46.23,48.85 42.42,45.3 36.82,45.3 36.32,44.8 36.32,43.51 35.31,42.5 28.45,42.5 28.19,42.25 28.19,37.93 27.69,37.42 v27.43,37.42
VCC
  Top 0.28: IC1.VCC-P1 40.92,33.79 C1.1
  Top 0.6: C1.1 39.9,34.52 R1.1
VCC1
  Top 0.5: R9.1 22.96,59.41 C11.1

### Text on the board
200bmp: (c) Shamba Technologies 2015 / Charger block rev 1.1